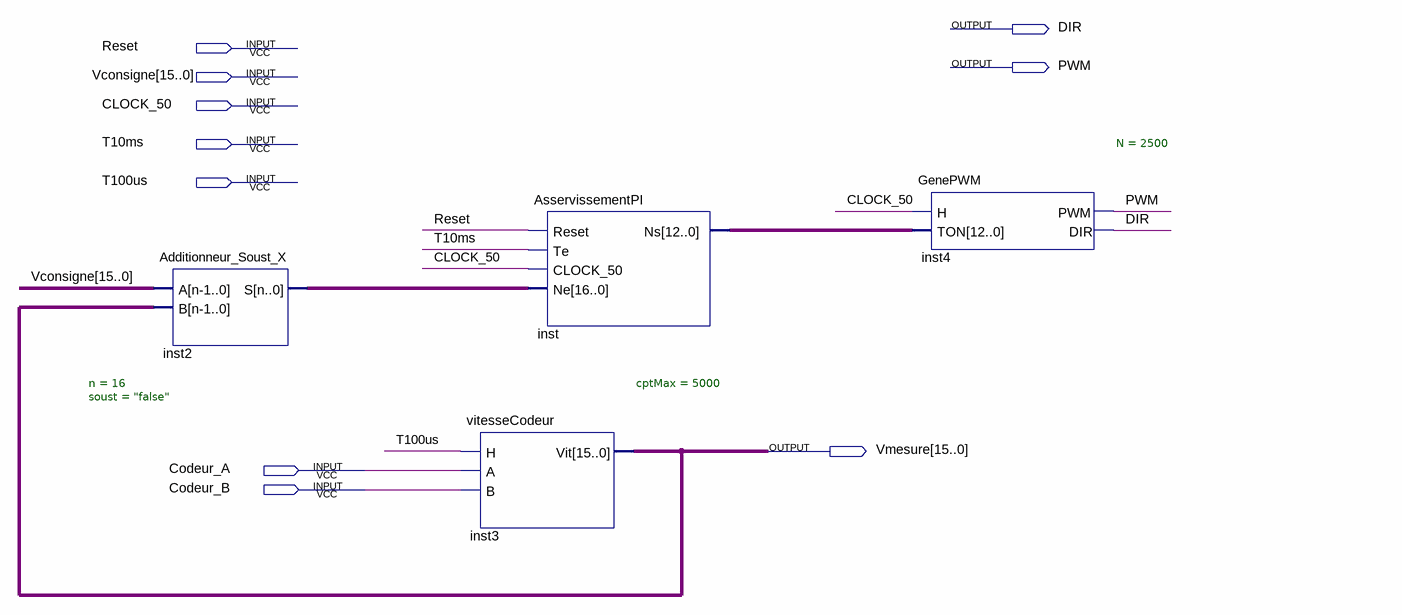
[diagram p0: schematic sheet]
// Quartus schematic AsservissementEMG30.bdf as structural Verilog: 4 symbols, 10 pins
module AsservissementEMG30 (
  input  Reset,
  input  [15:0] Vconsigne,
  input  CLOCK_50,
  input  T10ms,
  input  T100us,
  input  Codeur_A,
  input  Codeur_B,
  output DIR,
  output PWM,
  output [15:0] Vmesure
);

  wire [12:0] inst_ns;
  wire [16:0] inst2_s;

  Additionneur_Soust_X #(.n(16), .soust("false")) inst2 (.A(Vconsigne), .B(Vmesure), .S(inst2_s));
  vitesseCodeur #(.cptMax(5000)) inst3 (.H(T100us), .A(Codeur_A), .B(Codeur_B), .Vit(Vmesure));
  AsservissementPI inst (.Reset(Reset), .Te(T10ms), .CLOCK_50(CLOCK_50), .Ne(inst2_s), .Ns(inst_ns));
  GenePWM #(.N(2500)) inst4 (.H(CLOCK_50), .TON(inst_ns), .PWM(PWM), .DIR(DIR));
endmodule
